# EAGLE schematic EEZ Arduino shield+BP r2B6b (EAGLE 6.1)
Assembly variants: Farnell, TME

## Sheet 1 of 4
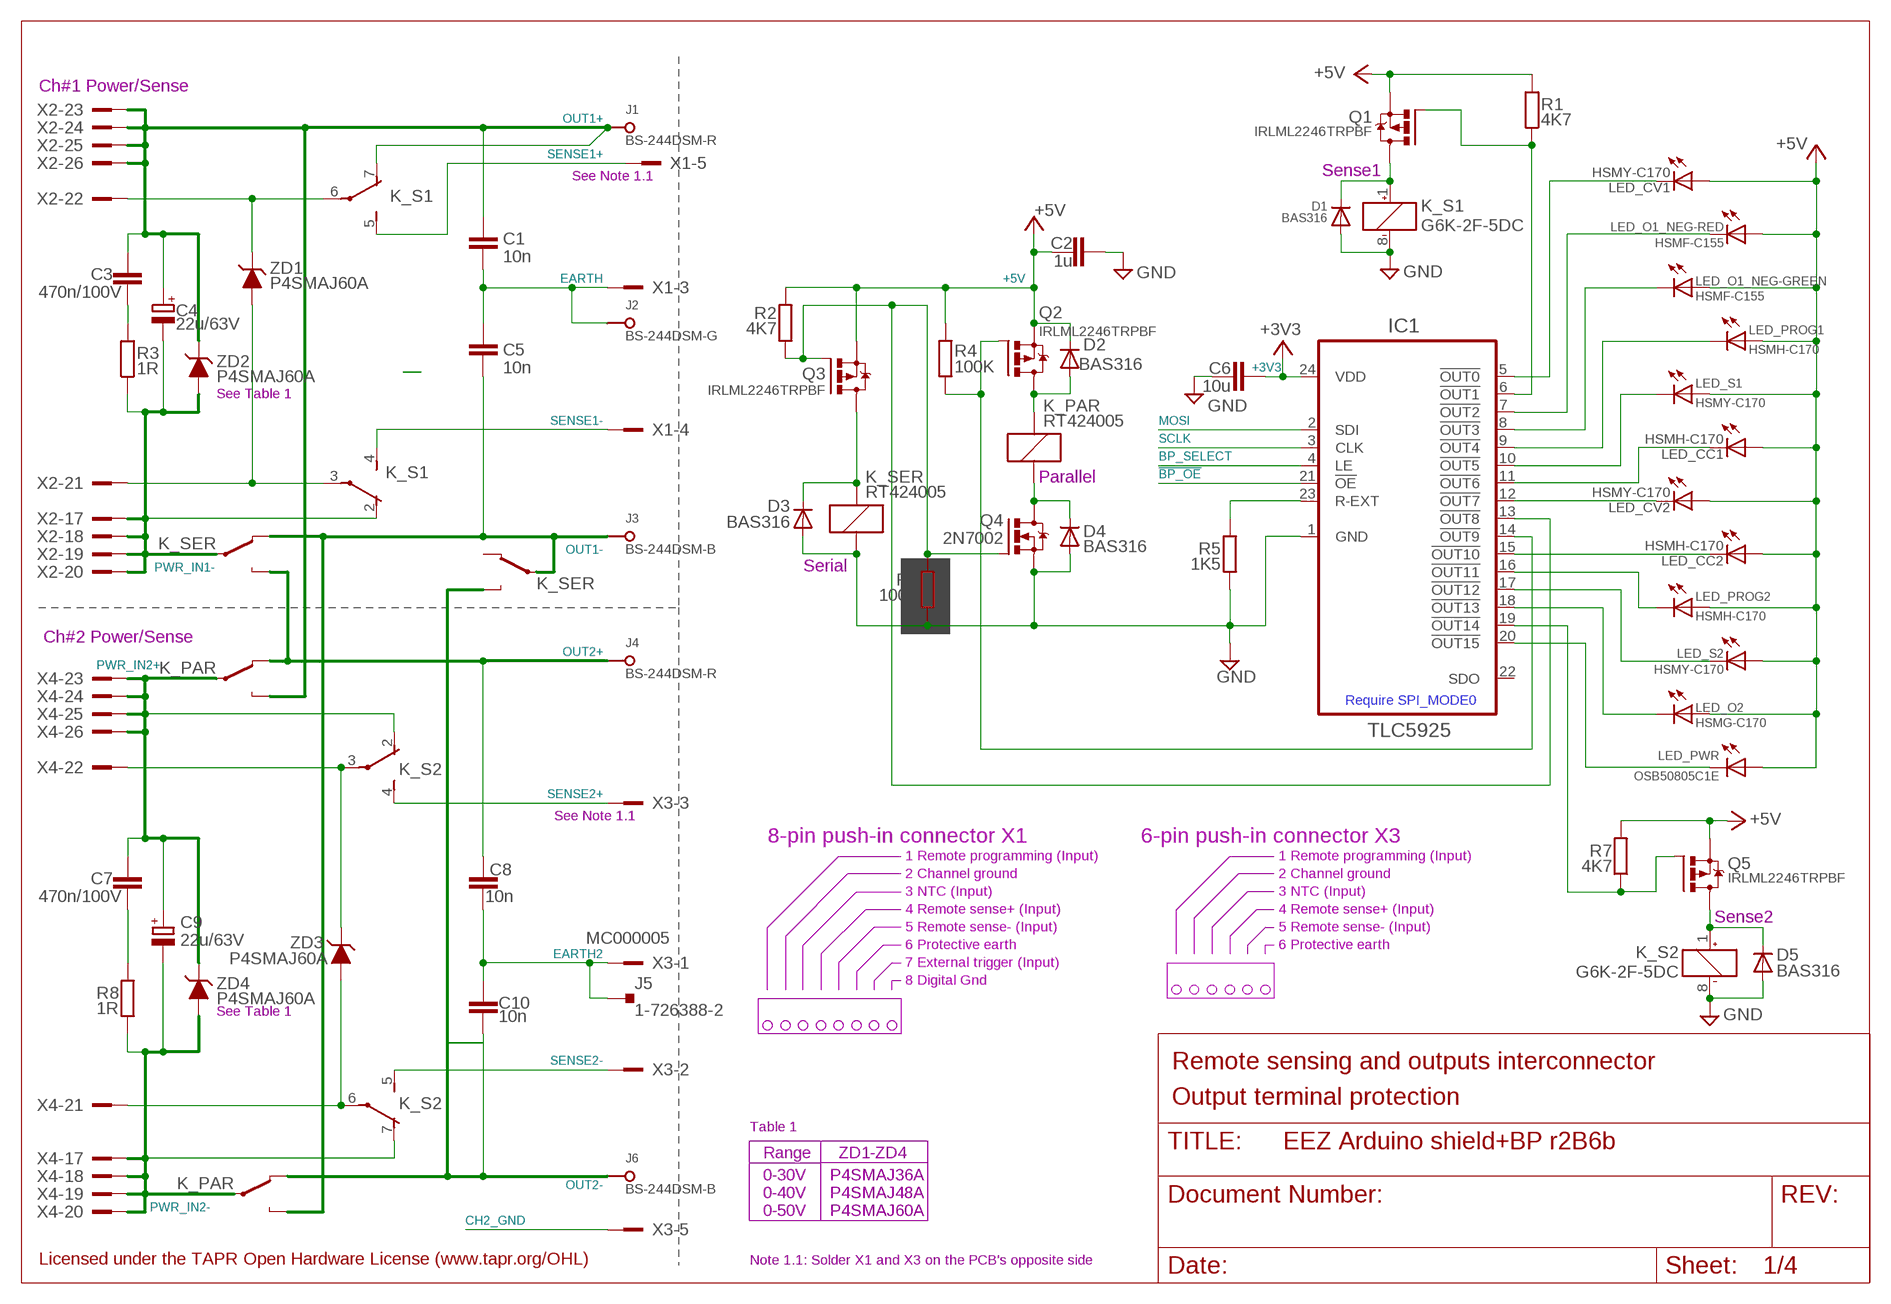
[diagram p0: schematic, sheet 1]

### Parts
C1  10n  C-EUC1206  [C1206]
C2  1u  C-EUC0805  [C0805]
C3  470n/100V  C-EUC1812  [C1812]
C4  22u/63V  ECAPEEEFK+2.5MM  [CAPAE660X610N_COMBO2]
C5  10n  C-EUC1206  [C1206]
C6  10u  C-EUC1206  [C1206]
C7  470n/100V  C-EUC1812  [C1812]
C8  10n  C-EUC1206  [C1206]
C9  22u/63V  ECAPEEEFK+2.5MM  [CAPAE660X610N_COMBO2]
C10  10n  C-EUC1206  [C1206]
D1  BAS316  DIODE-SOD323-W  [SOD323-W]
D2  BAS316  DIODE-SOD323-W  [SOD323-W]
D3  BAS316  DIODE-SOD323-W  [SOD323-W]
D4  BAS316  DIODE-SOD323-W  [SOD323-W]
D5  BAS316  DIODE-SOD323-W  [SOD323-W]
IC1  TLC5925  TLC5925IDBQR  [SOP63P600X175-24N]
J1  BS-244DSM-R  BINDING_POST-2  [BP_5_12]
J2  BS-244DSM-G  BINDING_POST-2  [BP_5_12]
J3  BS-244DSM-B  BINDING_POST-2  [BP_5_12]
J4  BS-244DSM-R  BINDING_POST-2  [BP_5_12]
J5  1-726388-2  PCB_TAB4.8MM  [PCB_TAB-4.8MM]
J6  BS-244DSM-B  BINDING_POST-2  [BP_5_12]
K_PAR  RT424005  RELAY_RT314012-2  [RT-C/016A5_ROUND]
K_S1  G6K-2F-5DC  G6K-2F  [G6K-2F]
K_S2  G6K-2F-5DC  G6K-2F  [G6K-2F]
K_SER  RT424005  RELAY_RT314012-2  [RT-C/016A5_ROUND]
LED_CC1  HSMH-C170  LEDCHIPLED_0805  [CHIPLED_0805]
LED_CC2  HSMH-C170  LEDCHIPLED_0805  [CHIPLED_0805]
LED_CV1  HSMY-C170  LEDCHIPLED_0805  [CHIPLED_0805]
LED_CV2  HSMY-C170  LEDCHIPLED_0805  [CHIPLED_0805]
LED_O1_NEG  HSMF-C155  LED_KPB-3025  [LED_KPB-3025]
LED_O2  HSMG-C170  LEDCHIPLED_0805  [CHIPLED_0805]
LED_PROG1  HSMH-C170  LEDCHIPLED_0805  [CHIPLED_0805]
LED_PROG2  HSMH-C170  LEDCHIPLED_0805  [CHIPLED_0805]
LED_PWR  OSB50805C1E  LEDCHIPLED_0805  [CHIPLED_0805]
LED_S1  HSMY-C170  LEDCHIPLED_0805  [CHIPLED_0805]
LED_S2  HSMY-C170  LEDCHIPLED_0805  [CHIPLED_0805]
Q1  IRLML2246TRPBF  [SOT95P237X112-3N]
Q2  IRLML2246TRPBF  [SOT95P237X112-3N]
Q3  IRLML2246TRPBF  [SOT95P237X112-3N]
Q4  2N7002  [SOT103P240X110-3N]
Q5  IRLML2246TRPBF  [SOT95P237X112-3N]
R1  4K7  R-EU_R0805  [R0805]
R2  4K7  R-EU_R0805  [R0805]
R3  1R  R-EU_R0805  [R0805]
R4  100K  R-EU_R0805  [R0805]
R5  1K5  R-EU_R0805  [R0805]
R6  100K  R-EU_R0805  [R0805]
R7  4K7  R-EU_R0805  [R0805]
R8  1R  R-EU_R0805  [R0805]
X1  MC000006  MC000006MIRROR  [MC000006_MIRROR]
X2  TSW-113-07-F-D  [TSW-113-07-F-D]
X3  MC000005  MC000005MIRROR  [MC000005_MIRROR]
X4  TSW-113-07-F-D  [TSW-113-07-F-D]
ZD1  P4SMAJ60A  PSMAXX  [DO214AC]
ZD2  P4SMAJ60A  PSMAXX  [DO214AC]
ZD3  P4SMAJ60A  PSMAXX  [DO214AC]
ZD4  P4SMAJ60A  PSMAXX  [DO214AC]

### Nets
!BP_OE: IC1.21(!OE) ; also sheet 2
!BP_OUT0: IC1.5(!OUT0) LED_CV1.C
!BP_OUT1: IC1.6(!OUT1) Q1.1(G) R1.1
!BP_OUT2: IC1.7(!OUT2) LED_O1_NEG.4(-RED:C)
!BP_OUT3: IC1.8(!OUT3) LED_O1_NEG.2(-GREEN:C)
!BP_OUT4: IC1.9(!OUT4) LED_PROG1.C
!BP_OUT5: IC1.10(!OUT5) LED_S1.C
!BP_OUT6: IC1.11(!OUT6) LED_CC1.C
!BP_OUT7: IC1.12(!OUT7) LED_CV2.C
!BP_OUT8: IC1.13(!OUT8) Q3.1(G) Q4.1(G) R2.1 R6.2
!BP_OUT9: IC1.14(!OUT9) Q2.1(G) R4.1
!BP_OUT10: IC1.15(!OUT10) LED_CC2.C
!BP_OUT12: IC1.17(!OUT12) LED_S2.C
!BP_OUT13: IC1.18(!OUT13) LED_O2.C
!BP_OUT14: IC1.19(!OUT14) Q5.1(G) R7.1
!BP_OUT15: IC1.20(!OUT15) LED_PWR.C
+3V3 [power]: C6.1 IC1.24(VDD) ; also sheet 2,3,4
+5V: C2.1 D2.C LED_CC1.A LED_CC2.A LED_CV1.A LED_CV2.A LED_O1_NEG.1(-GREEN:A) LED_O1_NEG.3(-RED:A) LED_O2.A LED_PROG1.A LED_PROG2.A LED_PWR.A LED_S1.A LED_S2.A Q1.2(S) Q2.2(S) Q3.2(S) Q5.2(S) R1.2 R2.2 R4.2 R7.2 ; also sheet 2,3,4
BP_SELECT: IC1.4(LE) ; also sheet 2
CH2_GND: X3.5 X3.5.1 ; also sheet 2,4
EARTH: C1.2 C5.1 J2.P$1 X1.3 X1.3.1
EARTH2: C8.2 C10.1 J5.P$1 J5.P$2 X3.1 X3.1.1 ; also sheet 3
GND [gnd]: C2.2 C6.2 D1.A D3.A D4.A D5.A IC1.1(GND) K_S1.8(1:-) K_S2.8(1:-) K_SER.A1(C2) Q4.2(S) R5.1 R6.1 ; also sheet 2,3,4
MOSI: IC1.2(SDI) ; also sheet 2,3
N$8: D1.C K_S1.1(1:+) Q1.3(D)
N$9: D5.C K_S2.1(1:+) Q5.3(D)
N$31: C3.2 R3.2
N$32: C7.2 R8.2
N$37: IC1.16(!OUT11) LED_PROG2.C
N$155: D3.C K_SER.A2(C1) Q3.3(D)
N$156: D2.A K_PAR.A2(C1) Q2.3(D)
N$306: IC1.23(R-EXT) R5.2
OUT1+: C1.1 C3.1 C4.1(+) C4.1.1(+) J1.P$1 K_PAR.14B(O) K_S1.7(3:O) X2.23 X2.24 X2.25 X2.26 ZD2.C
OUT1-: C5.2 J3.P$1 K_PAR.14A(O) K_SER.11A(P) K_SER.12B(S)
OUT2+: C8.1 J4.P$1 K_PAR.12B(S) K_SER.14B(O)
OUT2-: C10.2 J6.P$1 K_PAR.12A(S) K_SER.14A(O)
PWR_IN1-: C4.2(-) C4.2.1(-) K_S1.2(2:O) K_SER.11B(P) R3.1 X2.17 X2.18 X2.19 X2.20 ZD2.A
PWR_IN2+: C7.1 C9.1(+) C9.1.1(+) K_PAR.11B(P) K_S2.2(2:O) X4.23 X4.24 X4.25 X4.26 ZD4.C
PWR_IN2-: C9.2(-) C9.2.1(-) K_PAR.11A(P) K_S2.7(3:O) R8.1 X4.17 X4.18 X4.19 X4.20 ZD4.A
SCLK: IC1.3(CLK) ; also sheet 2,3
SENSE1+: K_S1.5(3:S) X1.5 X1.5.1
SENSE1-: K_S1.4(2:S) X1.4 X1.4.1
SENSE1_IN+: K_S1.6(3:P) X2.22 ZD1.C
SENSE1_IN-: K_S1.3(2:P) X2.21 ZD1.A
SENSE2+: K_S2.4(2:S) X3.3 X3.3.1
SENSE2-: K_S2.5(3:S) X3.2 X3.2.1
SENSE2_IN+: K_S2.3(2:P) X4.22 ZD3.C
SENSE2_IN-: K_S2.6(3:P) X4.21 ZD3.A
V-2: D4.C K_PAR.A1(C2) Q4.3(D)
Unconnected: IC1.22(SDO) K_SER.12A(S) X3.4 X3.4.1

### Notes on the sheet
- Ch#1 Power/Sense
- Sense1
- See Note 1.1
- See Table 1
- Parallel
- Serial
- Ch#2 Power/Sense
- Require SPI_MODE0
- See Note 1.1
- 8-pin push-in connector X1 | 6-pin push-in connector X3
- 1 Remote programming (Input) | 1 Remote programming (Input)
- 2 Channel ground | 2 Channel ground
- 3 NTC (Input) | 3 NTC (Input)
- 4 Remote sense+ (Input) | 4 Remote sense+ (Input)
- Sense2
- 5 Remote sense- (Input) | 5 Remote sense- (Input)
- 6 Protective earth | 6 Protective earth
- 7 External trigger (Input)
- 8 Digital Gnd
- See Table 1
- Remote sensing and outputs interconnector
- Output terminal protection
- Table 1
- Range | ZD1-ZD4
- 0-30V | P4SMAJ36A
- 0-40V | P4SMAJ48A
- 0-50V | P4SMAJ60A
- Licensed under the TAPR Open Hardware License (www.tapr.org/OHL) | Note 1.1: Solder X1 and X3 on the PCB's opposite side

## Sheet 2 of 4
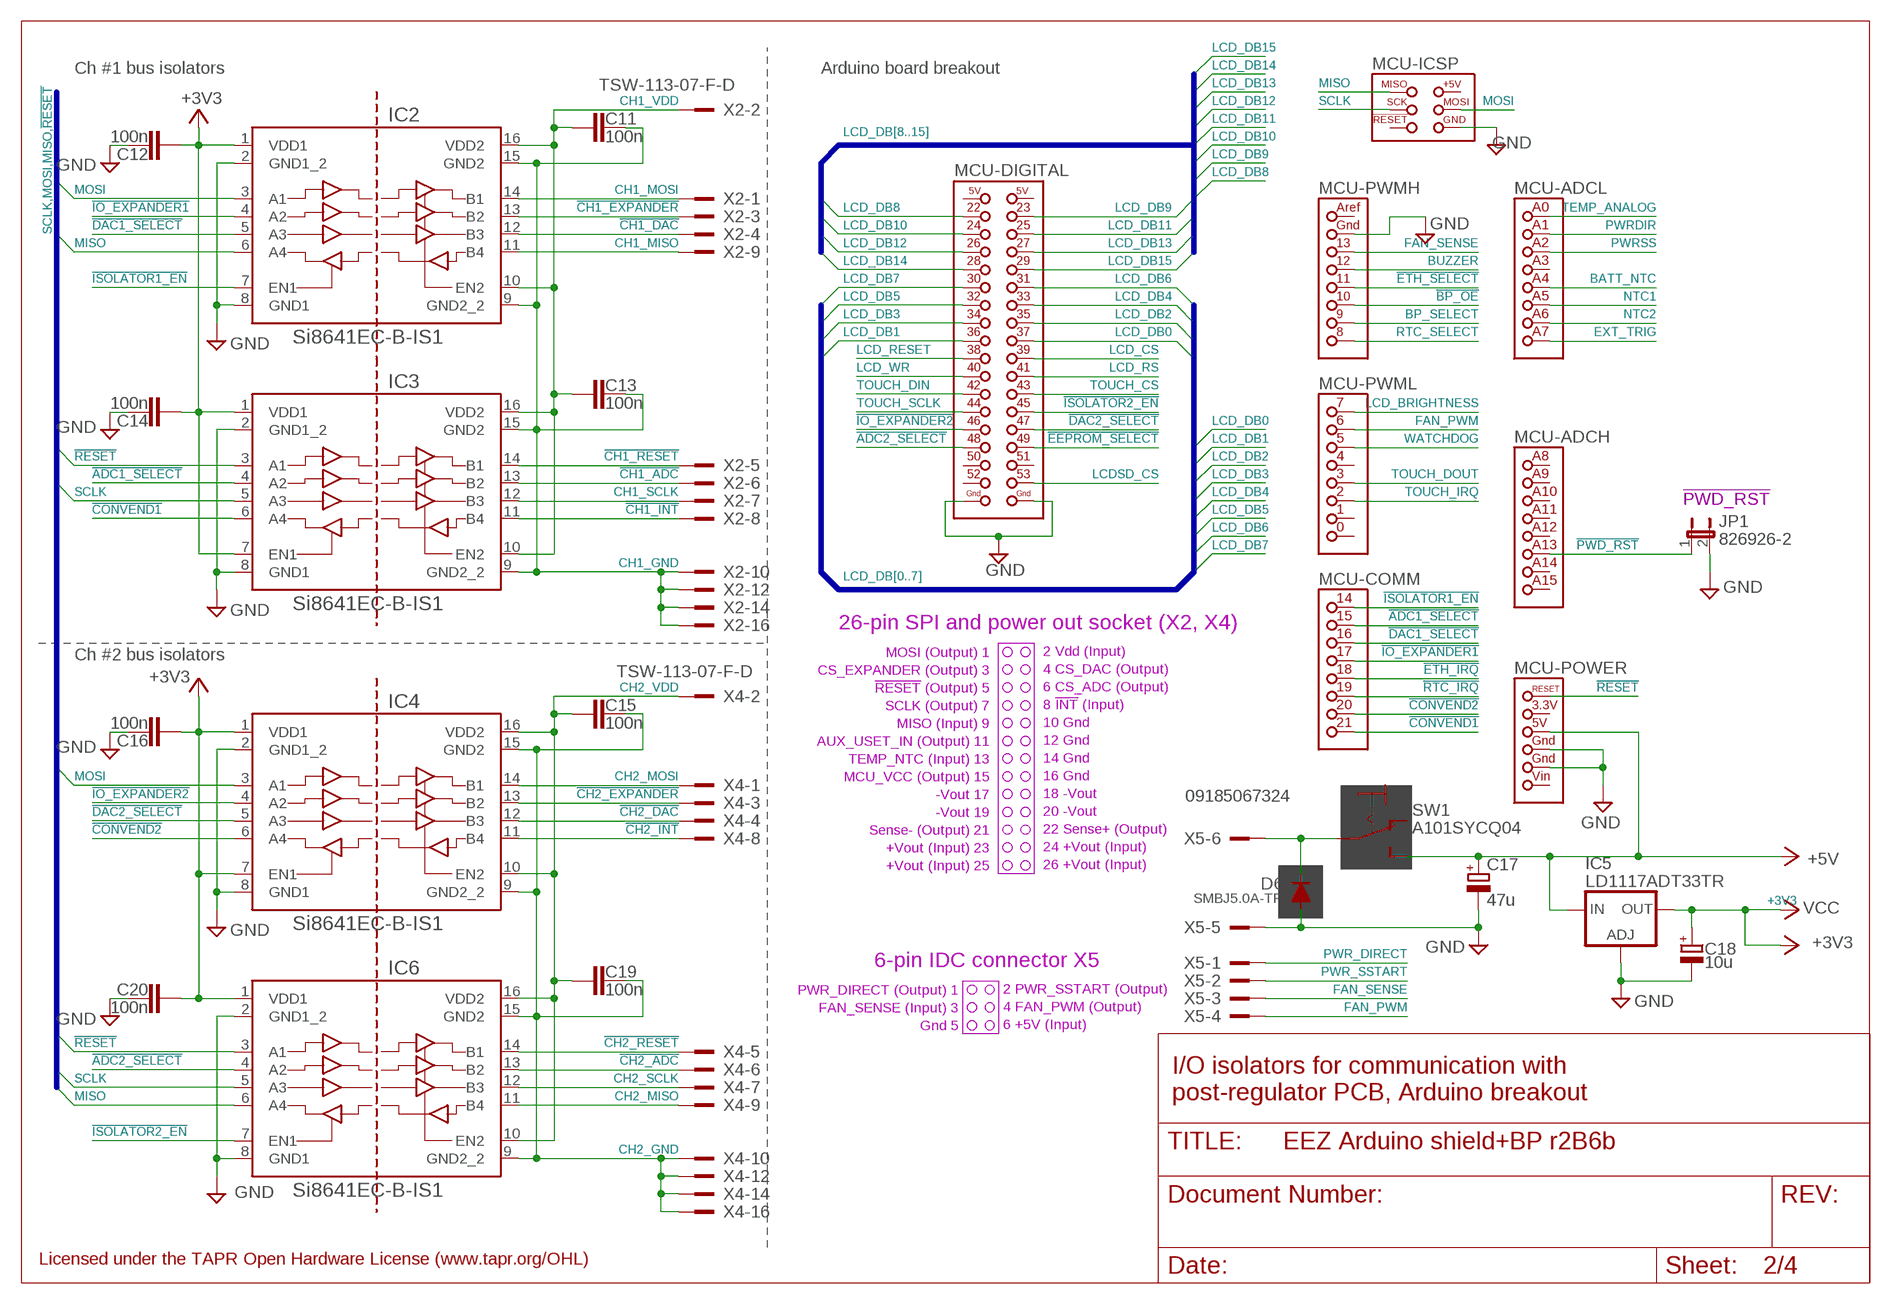
[diagram p1: schematic, sheet 2]

### Parts
C11  100n  C-EUC0603  [C0603]
C12  100n  C-EUC0603  [C0603]
C13  100n  C-EUC0603  [C0603]
C14  100n  C-EUC0603  [C0603]
C15  100n  C-EUC0603  [C0603]
C16  100n  C-EUC0603  [C0603]
C17  47u  ECAPPANASONIC_C  [PANASONIC_C]
C18  10u  ECAPPANASONIC_C  [PANASONIC_C]
C19  100n  C-EUC0603  [C0603]
C20  100n  C-EUC0603  [C0603]
D6  SMBJ5.0A-TR  DIODEDO214AA  [DO214AA]
IC2  Si8641EC-B-IS1  SI8641NSOIC-16  [SOIC-16]
IC3  Si8641EC-B-IS1  SI8641NSOIC-16  [SOIC-16]
IC4  Si8641EC-B-IS1  SI8641NSOIC-16  [SOIC-16]
IC5  LD1117ADT33TR  LD117ADT33TR  [DPACK]
IC6  Si8641EC-B-IS1  SI8641NSOIC-16  [SOIC-16]
JP1  826926-2  JP1E  [JP1]
MCU  Arduino Due  ARDUINO_MEGA+ICSPMIRROR  [ARDUINO+ICSP_MIRROR]
SW1  A101SYCQ04  M9040P  [M9040P]
X5  09185067324  IDC-6PIN  [IDC-6PIN]

### Nets
!ADC1_SELECT: IC3.4(A2) MCU.15
!ADC2_SELECT: IC6.4(A2) MCU.48(-DIGITAL:48(PL3))
!BP_OE: MCU.10 ; also sheet 1
!CH1_ADC: IC3.13(B2) X2.6
!CH1_DAC: IC2.12(B3) X2.4
!CH1_EXPANDER: IC2.13(B2) X2.3
!CH1_INT: IC3.11(B4) X2.8
!CH1_RESET: IC3.14(B1) X2.5
!CH2_ADC: IC6.13(B2) X4.6
!CH2_DAC: IC4.12(B3) X4.4
!CH2_EXPANDER: IC4.13(B2) X4.3
!CH2_INT: IC4.11(B4) X4.8
!CH2_RESET: IC6.14(B1) X4.5
!CONVEND1: IC3.6(A4) MCU.21
!CONVEND2: IC4.6(A4) MCU.20
!DAC1_SELECT: IC2.5(A3) MCU.16
!DAC2_SELECT: IC4.5(A3) MCU.47(-DIGITAL:47(PL4))
!EEPROM_SELECT: MCU.49(-DIGITAL:49(PL2)) ; also sheet 3
!ETH_IRQ: MCU.18 ; also sheet 3
!ETH_SELECT: MCU.11 ; also sheet 3
!IO_EXPANDER1: IC2.4(A2) MCU.17
!IO_EXPANDER2: IC4.4(A2) MCU.46(-DIGITAL:46(PL5))
!ISOLATOR1_EN: IC2.7(EN1) MCU.14
!ISOLATOR2_EN: IC6.7(EN1) MCU.45(-DIGITAL:45(PL6))
!PWD_RST: JP1.1 MCU.A13(-ADCH:ADC13)
!RESET: IC3.3(A1) IC6.3(A1) MCU.RESET(-POWER:!RESET) ; also sheet 3,4
!RTC_IRQ: MCU.19 ; also sheet 3
+3V3 [power]: C12.1 C14.1 C16.1 C18.1(+) C20.1 IC2.1(VDD1) IC3.1(VDD1) IC3.7(EN1) IC4.1(VDD1) IC4.7(EN1) IC5.4(OUT) IC6.1(VDD1) ; supply symbol labelled VCC ; also sheet 1,3,4
+5V: C17.1(+) IC5.3(IN) MCU.5V(-POWER:5V) SW1.3(S) ; also sheet 1,3,4
BATT_NTC: MCU.A4(-ADCL:ADC4) ; also sheet 4
BP_SELECT: MCU.9(-PWMH:9(PH6)) ; also sheet 1
BUZZER: MCU.12 ; also sheet 3
CH1_GND: C11.2 C13.2 IC2.9(GND2_2) IC2.15(GND2) IC3.9(GND2_2) IC3.15(GND2) X2.10 X2.12 X2.14 X2.16 ; also sheet 4
CH1_MISO: IC2.11(B4) X2.9
CH1_MOSI: IC2.14(B1) X2.1
CH1_SCLK: IC3.12(B3) X2.7
CH1_VDD: C11.1 C13.1 IC2.10(EN2) IC2.16(VDD2) IC3.10(EN2) IC3.16(VDD2) X2.2 ; also sheet 4
CH2_GND: C15.2 C19.2 IC4.9(GND2_2) IC4.15(GND2) IC6.9(GND2_2) IC6.15(GND2) X4.10 X4.12 X4.14 X4.16 ; also sheet 1,4
CH2_MISO: IC6.11(B4) X4.9
CH2_MOSI: IC4.14(B1) X4.1
CH2_SCLK: IC6.12(B3) X4.7
CH2_VDD: C15.1 C19.1 IC4.10(EN2) IC4.16(VDD2) IC6.10(EN2) IC6.16(VDD2) X4.2
EXT_TRIG: MCU.A7(-ADCL:ADC7) ; also sheet 4
FAN_PWM: MCU.6(-PWML:6(PH3)) X5.4
FAN_SENSE: MCU.13 X5.3
GND [gnd]: C12.2 C14.2 C16.2 C17.2(-) C18.2(-) C20.2 D6.A IC2.2(GND1_2) IC2.8(GND1) IC3.2(GND1_2) IC3.8(GND1) IC4.2(GND1_2) IC4.8(GND1) IC5.1(ADJ) IC6.2(GND1_2) IC6.8(GND1) JP1.2 MCU.GND1(-POWER:GND1) MCU.GND2(-POWER:GND2) MCU.GND3(-DIGITAL:GND3) MCU.GND4(-DIGITAL:GND4) MCU.GND(-PWMH:GND) MCU.ICSP_GND(-ICSP:GND) X5.5 ; also sheet 1,3,4
LCD_BRIGHTNESS: MCU.7(-PWML:7(PH4)) ; also sheet 3
LCD_CS: MCU.39(-DIGITAL:39(PC0)) ; also sheet 3
LCD_DB0: MCU.37(-DIGITAL:37(PC2)) ; also sheet 3
LCD_DB1: MCU.36(-DIGITAL:36(PC3)) ; also sheet 3
LCD_DB2: MCU.35(-DIGITAL:35(PC4)) ; also sheet 3
LCD_DB3: MCU.34(-DIGITAL:34(PC5)) ; also sheet 3
LCD_DB4: MCU.33(-DIGITAL:33(PC6)) ; also sheet 3
LCD_DB5: MCU.32(-DIGITAL:32(PC7)) ; also sheet 3
LCD_DB6: MCU.31(-DIGITAL:31(PA7)) ; also sheet 3
LCD_DB7: MCU.30(-DIGITAL:30(PA6)) ; also sheet 3
LCD_DB8: MCU.22 ; also sheet 3
LCD_DB9: MCU.23 ; also sheet 3
LCD_DB10: MCU.24(-DIGITAL:24(PA0)) ; also sheet 3
LCD_DB11: MCU.25(-DIGITAL:25(PA1)) ; also sheet 3
LCD_DB12: MCU.26(-DIGITAL:26(PA2)) ; also sheet 3
LCD_DB13: MCU.27(-DIGITAL:27(PA3)) ; also sheet 3
LCD_DB14: MCU.28(-DIGITAL:28(PA4)) ; also sheet 3
LCD_DB15: MCU.29(-DIGITAL:29(PA5)) ; also sheet 3
LCD_RESET: MCU.38(-DIGITAL:38(PC1)) ; also sheet 3
LCD_RS: MCU.41(-DIGITAL:41(PG2)) ; also sheet 3
LCD_WR: MCU.40(-DIGITAL:40(PD7)) ; also sheet 3
LCDSD_CS: MCU.53(-DIGITAL:53(PB2/MOSI)) ; also sheet 3
MISO: IC2.6(A4) IC6.6(A4) MCU.ICSP_MISO(-ICSP:MISO) ; also sheet 3
MOSI: IC2.3(A1) IC4.3(A1) MCU.ICSP_MOSI(-ICSP:MOSI) ; also sheet 1,3
N$1: D6.C SW1.2(P) X5.6
NTC1: MCU.A5(-ADCL:ADC5) ; also sheet 3
NTC2: MCU.A6(-ADCL:ADC6) ; also sheet 3
PWR_DIRECT: X5.1 ; also sheet 4
PWR_SSTART: X5.2 ; also sheet 4
PWRDIR: MCU.A1(-ADCL:ADC1) ; also sheet 4
PWRSS: MCU.A2(-ADCL:ADC2) ; also sheet 4
RTC_SELECT: MCU.8(-PWMH:8(PH5)) ; also sheet 3
SCLK: IC3.5(A3) IC6.5(A3) MCU.ICSP_SCK(-ICSP:SCK) ; also sheet 1,3
TEMP_ANALOG: MCU.A0(-ADCL:ADC0) ; also sheet 3
TOUCH_CS: MCU.43(-DIGITAL:43(PG0)) ; also sheet 3
TOUCH_DIN: MCU.42(-DIGITAL:42(PG1)) ; also sheet 3
TOUCH_DOUT: MCU.3(-PWML:3(PE5)) ; also sheet 3
TOUCH_IRQ: MCU.2(-PWML:2(PE4)) ; also sheet 3
TOUCH_SCLK: MCU.44(-DIGITAL:44(PL7)) ; also sheet 3
WATCHDOG: MCU.5(-PWML:5(PE3)) ; also sheet 4
Unconnected: MCU.0(-PWML:0(PE0)) MCU.1(-PWML:1(PE1)) MCU.3.3V(-POWER:3V3) MCU.4(-PWML:4(PG5)) MCU.5V(1)(-DIGITAL:5V(1)) MCU.5V(2)(-DIGITAL:5V(2)) MCU.50(-DIGITAL:50(PL1/MISO)) MCU.51(-DIGITAL:51(PL0)) MCU.52(-DIGITAL:52(PB3/SCK)) MCU.A3(-ADCL:ADC3) MCU.A8(-ADCH:ADC8) MCU.A9(-ADCH:ADC9) MCU.A10(-ADCH:ADC10) MCU.A11(-ADCH:ADC11) MCU.A12(-ADCH:ADC12) MCU.A14(-ADCH:ADC14) MCU.A15(-ADCH:ADC15) MCU.AREF(-PWMH:AREF) MCU.ICSP_+5V(-ICSP:+5V) MCU.ICSP_RESET(-ICSP:!RESET) MCU.VIN(-POWER:VIN) SW1.1(O)

### Buses
SCLK,MOSI,MISO,!RESET
LCD_DB[8..15]
LCD_DB[0..7]

### Notes on the sheet
- Ch #1 bus isolators | Arduino board breakout
- !PWD_RST
- 26-pin SPI and power out socket (X2, X4)
- MOSI (Output) 1
- 2 Vdd (Input)
- Ch #2 bus isolators
- CS_EXPANDER (Output) 3
- 4 CS_DAC (Output)
- !RESET! (Output) 5
- 6 CS_ADC (Output)
- SCLK (Output) 7
- 8 !INT! (Input)
- MISO (Input) 9
- 10 Gnd
- AUX_USET_IN (Output) 11
- 12 Gnd
- TEMP_NTC (Input) 13
- 14 Gnd
- MCU_VCC (Output) 15
- 16 Gnd
- -Vout 17
- 18 -Vout
- -Vout 19
- 20 -Vout
- Sense- (Output) 21
- 22 Sense+ (Output)
- +Vout (Input) 23
- 24 +Vout (Input)
- +Vout (Input) 25
- 26 +Vout (Input)
- 6-pin IDC connector X5
- PWR_DIRECT (Output) 1
- 2 PWR_SSTART (Output)
- FAN_SENSE (Input) 3
- 4 FAN_PWM (Output)
- Gnd 5
- 6 +5V (Input)
- I/O isolators for communication with
- post-regulator PCB, Arduino breakout
- Licensed under the TAPR Open Hardware License (www.tapr.org/OHL)

## Sheet 3 of 4
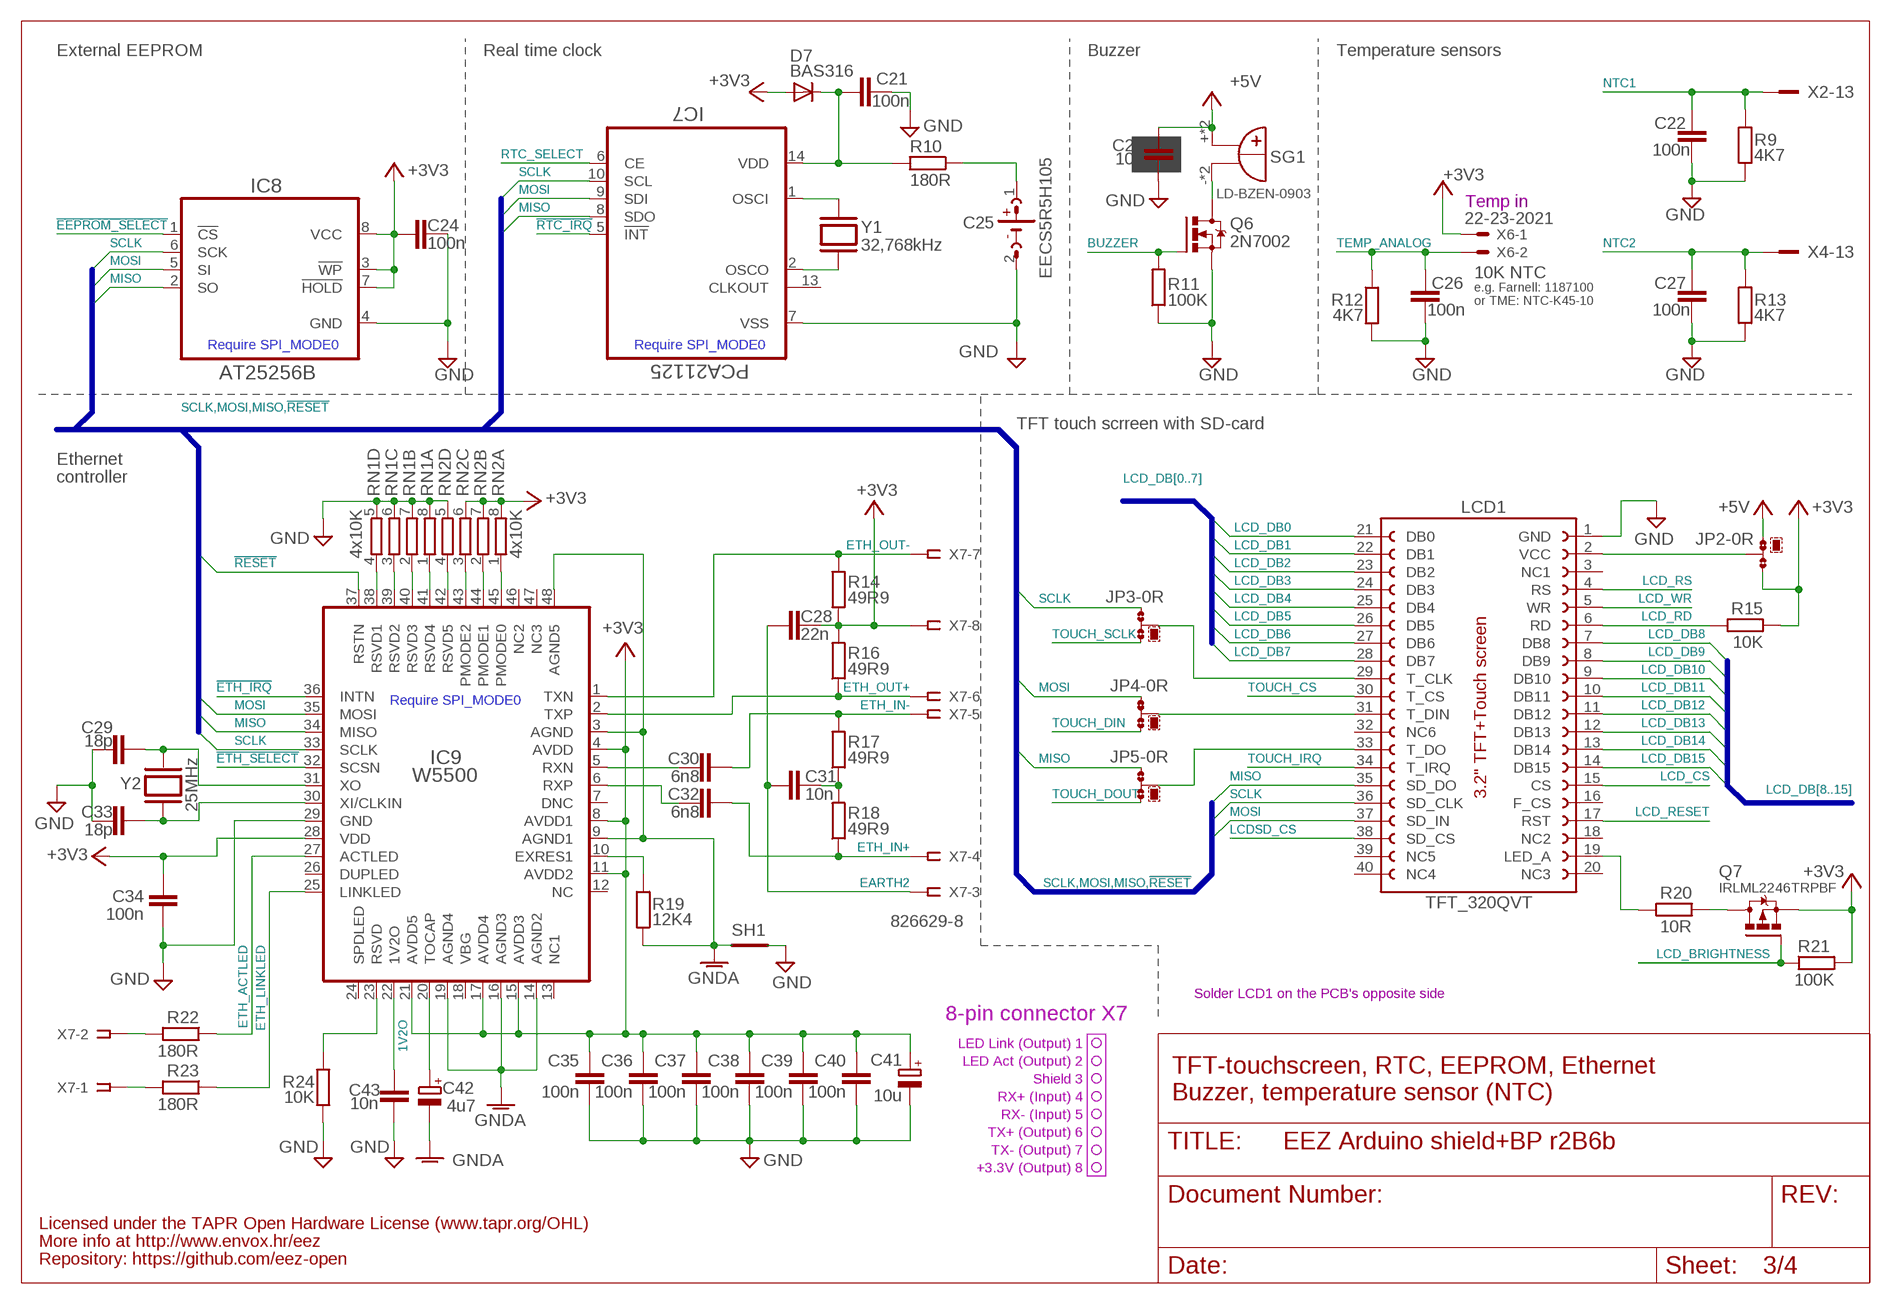
[diagram p2: schematic, sheet 3]

### Parts
C21  100n  C-EUC0603  [C0603]
C22  100n  C-EUC0603  [C0603]
C23  10u  C-EUC1206  [C1206]
C24  100n  C-EUC0603  [C0603]
C25  EECS5R5H105  SUPER_CAP  [SG-R20MM]
C26  100n  C-EUC0603  [C0603]
C27  100n  C-EUC0603  [C0603]
C28  22n  C-EUC0805  [C0805]
C29  18p  C-EUC0603  [C0603]
C30  6n8  C-EUC0603  [C0603]
C31  10n  C-EUC0805  [C0805]
C32  6n8  C-EUC0603  [C0603]
C33  18p  C-EUC0603  [C0603]
C34  100n  C-EUC0603  [C0603]
C35  100n  C-EUC0603  [C0603]
C36  100n  C-EUC0603  [C0603]
C37  100n  C-EUC0603  [C0603]
C38  100n  C-EUC0603  [C0603]
C39  100n  C-EUC0603  [C0603]
C40  100n  C-EUC0603  [C0603]
C41  10u  ECAP1206  [EC1206]
C42  4u7  ECAP1206  [EC1206]
C43  10n  C-EUC0805  [C0805]
D7  BAS316  DIODE-SOD323-W  [SOD323-W]
IC7  PCA21125  PCA21125TSSOP-14  [SOP65P640X120-14N]
IC8  AT25256B  AT25XXXSOIC8  [SOIC127P600X175-8N]
IC9  W5500  [TQFP48-7X7]
JP2  0R-JUMPA  [A0R-JMP]
JP3  0R-JUMPA  [A0R-JMP]
JP4  0R-JUMPA  [A0R-JMP]
JP5  0R-JUMPA  [A0R-JMP]
LCD1  TFT_320QVT  LCD_TFT_320QVTMIRROR  [LCD_TFT_320QVT_MIRROR]
Q6  2N7002  [SOT103P240X110-3N]
Q7  IRLML2246TRPBF  [SOT95P237X112-3N]
R9  4K7  R-EU_R0805  [R0805]
R10  180R  R-EU_R0805  [R0805]
R11  100K  R-EU_R0805  [R0805]
R12  4K7  R-EU_R0805  [R0805]
R13  4K7  R-EU_R0805  [R0805]
R14  49R9  R-EU_R0805  [R0805]
R15  10K  R-EU_R0805  [R0805]
R16  49R9  R-EU_R0805  [R0805]
R17  49R9  R-EU_R0805  [R0805]
R18  49R9  R-EU_R0805  [R0805]
R19  12K4  R-EU_R0805  [R0805]
R20  10R  R-EU_R0805  [R0805]
R21  100K  R-EU_R0805  [R0805]
R22  180R  R-EU_R0805  [R0805]
R23  180R  R-EU_R0805  [R0805]
R24  10K  R-EU_R0805  [R0805]
RN1  4x10K  R_ARRAY4  [CAY16]
RN2  4x10K  R_ARRAY4  [CAY16]
SG1  LD-BZEN-0903  BUZZER  [BUZZER]
SH1  SHORTNOHOLE  [SHORT_NOHOLE]
X6  22-23-2021  [22-23-2021]
X7  826629-8  SSW-108-02-S-S  [SSW-108-02-S-S]
Y1  32,768kHz  XTALR26  [R26_XTAL]
Y2  25MHz  XTALSMD  [HC-49/4H]

### Nets
1V2O: C43.2 IC9.22(1V2O)
!EEPROM_SELECT: IC8.1(!CS) ; also sheet 2
!ETH_IRQ: IC9.36(INTN) ; also sheet 2
!ETH_SELECT: IC9.32(SCSN) ; also sheet 2
!RESET: IC9.37(RSTN) ; also sheet 2,4
!RTC_IRQ: IC7.5(!INT) ; also sheet 2
+3V3 [power]: C24.1 C28.1 C34.2 C35.1 C36.1 C37.1 C38.1 C39.1 C40.1 C41.+ D7.A IC8.3(!WP) IC8.7(!HOLD) IC8.8(VCC) IC9.4(AVDD) IC9.8(AVDD1) IC9.11(AVDD2) IC9.15(AVDD3) IC9.17(AVDD4) IC9.21(AVDD5) IC9.28(VDD) JP2.3 Q7.2(S) R14.1 R15.2 R16.2 R21.2 RN2.6 RN2.7 RN2.8 X6.1 X7.8 ; also sheet 1,2,4
+5V: C23.2 JP2.1 SG1.+ SG1.+B(+) ; also sheet 1,2,4
BUZZER: Q6.1(G) R11.2 ; also sheet 2
EARTH2: C28.2 C31.2 X7.3 ; also sheet 1
ETH_ACTLED: IC9.27(ACTLED) R22.1
ETH_IN+: C32.1 R18.1 X7.4
ETH_IN-: C30.1 R17.2 X7.5
ETH_LINKLED: IC9.25(LINKLED) R23.1
ETH_OUT+: IC9.2(TXP) R16.1 X7.6
ETH_OUT-: IC9.1(TXN) R14.2 X7.7
GND [gnd]: C21.1 C22.1 C23.1 C24.2 C25.2(-) C26.1 C27.1 C29.2 C33.2 C34.1 C35.2 C36.2 C37.2 C38.2 C39.2 C40.2 C41.- C43.1 IC7.7(VSS) IC8.4(GND) IC9.29(GND) LCD1.1(GND) Q6.2(S) R9.2 R11.1 R12.2 R13.2 R24.1 RN1.5 RN1.6 RN1.7 RN1.8 RN2.5 SH1.P$1(GND_A) ; also sheet 1,2,4
GNDA [gnd]: C42.- IC9.3(AGND) IC9.9(AGND1) IC9.14(AGND2) IC9.16(AGND3) IC9.19(AGND4) IC9.48(AGND5) R19.1 SH1.P$2(GND_B)
LCD_BRIGHTNESS: Q7.1(G) R21.1 ; also sheet 2
LCD_CS: LCD1.15(CS) ; also sheet 2
LCD_DB0: LCD1.21(DB0) ; also sheet 2
LCD_DB1: LCD1.22(DB1) ; also sheet 2
LCD_DB2: LCD1.23(DB2) ; also sheet 2
LCD_DB3: LCD1.24(DB3) ; also sheet 2
LCD_DB4: LCD1.25(DB4) ; also sheet 2
LCD_DB5: LCD1.26(DB5) ; also sheet 2
LCD_DB6: LCD1.27(DB6) ; also sheet 2
LCD_DB7: LCD1.28(DB7) ; also sheet 2
LCD_DB8: LCD1.7(DB8) ; also sheet 2
LCD_DB9: LCD1.8(DB9) ; also sheet 2
LCD_DB10: LCD1.9(DB10) ; also sheet 2
LCD_DB11: LCD1.10(DB11) ; also sheet 2
LCD_DB12: LCD1.11(DB12) ; also sheet 2
LCD_DB13: LCD1.12(DB13) ; also sheet 2
LCD_DB14: LCD1.13(DB14) ; also sheet 2
LCD_DB15: LCD1.14(DB15) ; also sheet 2
LCD_RD: LCD1.6(RD) R15.1
LCD_RESET: LCD1.17(RST) ; also sheet 2
LCD_RS: LCD1.4(RS) ; also sheet 2
LCD_WR: LCD1.5(WR) ; also sheet 2
LCDSD_CS: LCD1.38(SD_CS) ; also sheet 2
LED_A: LCD1.19(LED_A) R20.2
MISO: IC7.8(SDO) IC8.2(SO) IC9.34(MISO) JP5.1 LCD1.35(SD_DO) ; also sheet 2
MOSI: IC7.9(SDI) IC8.5(SI) IC9.35(MOSI) JP4.1 LCD1.37(SD_IN) ; also sheet 1,2
N$2: JP5.2 LCD1.33(T_DO)
N$4: C33.1 IC9.30(XI/CLKIN) Y2.2
N$5: IC9.23(RSVD) R24.2
N$6: C30.2 IC9.5(RXN)
N$7: C32.2 IC9.6(RXP)
N$10 [power]: JP2.2 LCD1.2(VCC)
N$11: IC9.43(PMODE2) RN2.3
N$12: IC9.44(PMODE1) RN2.2
N$13: Q7.3(D) R20.1
N$14: IC9.45(PMODE0) RN2.1
N$15: IC9.42(RSVD5) RN2.4
N$16: JP4.2 LCD1.31(T_DIN)
N$18: JP3.2 LCD1.29(T_CLK)
N$22: C25.1(+) R10.1
N$23: IC9.38(RSVD1) RN1.4
N$24: IC7.1(OSCI) Y1.1
N$25: IC7.2(OSCO) Y1.2
N$28: IC9.39(RSVD2) RN1.3
N$29: IC9.41(RSVD4) RN1.1
N$36: IC9.40(RSVD3) RN1.2
N$40: R23.2 X7.1
N$41: R22.2 X7.2
N$45: IC9.10(EXRES1) R19.2
N$71: Q6.3(D) SG1.- SG1.-B(-)
N$97: C29.1 IC9.31(XO) Y2.1
N$109: C21.2 D7.C IC7.14(VDD) R10.2
N$124: C31.1 R17.1 R18.2
NTC1: C22.2 R9.1 X2.13 ; also sheet 2
NTC2: C27.2 R13.1 X4.13 ; also sheet 2
RTC_SELECT: IC7.6(CE) ; also sheet 2
SCLK: IC7.10(SCL) IC8.6(SCK) IC9.33(SCLK) JP3.1 LCD1.36(SD_CLK) ; also sheet 1,2
TEMP_ANALOG: C26.2 R12.1 X6.2 ; also sheet 2
TOCAP: C42.+ IC9.20(TOCAP)
TOUCH_CS: LCD1.30(T_CS) ; also sheet 2
TOUCH_DIN: JP4.3 ; also sheet 2
TOUCH_DOUT: JP5.3 ; also sheet 2
TOUCH_IRQ: LCD1.34(T_IRQ) ; also sheet 2
TOUCH_SCLK: JP3.3 ; also sheet 2
Unconnected: IC7.13(CLKOUT) IC9.7(DNC) IC9.12(NC) IC9.13(NC1) IC9.18(VBG) IC9.24(SPDLED) IC9.26(DUPLED) IC9.46(NC2) IC9.47(NC3) LCD1.3(NC1) LCD1.16(F_CS) LCD1.18(NC2) LCD1.20(NC3) LCD1.32(NC6) LCD1.39(NC5) LCD1.40(NC4)

### Buses
SCLK,MOSI,MISO,!RESET
LCD_DB[0..7]
LCD_DB[8..15]

### Notes on the sheet
- External EEPROM | Real time clock | Buzzer | Temperature sensors
- Temp in
- 10K NTC
- e.g. Farnell: 1187100
- or TME: NTC-K45-10
- Require SPI_MODE0 | Require SPI_MODE0
- TFT touch scrreen with SD-card
- Ethernet
- controller
- Require SPI_MODE0
- Solder LCD1 on the PCB's opposite side
- 8-pin connector X7
- LED Link (Output) 1
- LED Act (Output) 2
- Shield 3 | TFT-touchscreen, RTC, EEPROM, Ethernet
- RX+ (Input) 4
- Buzzer, temperature sensor (NTC)
- RX- (Input) 5
- TX+ (Output) 6
- TX- (Output) 7
- +3.3V (Output) 8
- Licensed under the TAPR Open Hardware License (www.tapr.org/OHL)
- More info at http://www.envox.hr/eez
- Repository: https://github.com/eez-open

## Sheet 4 of 4
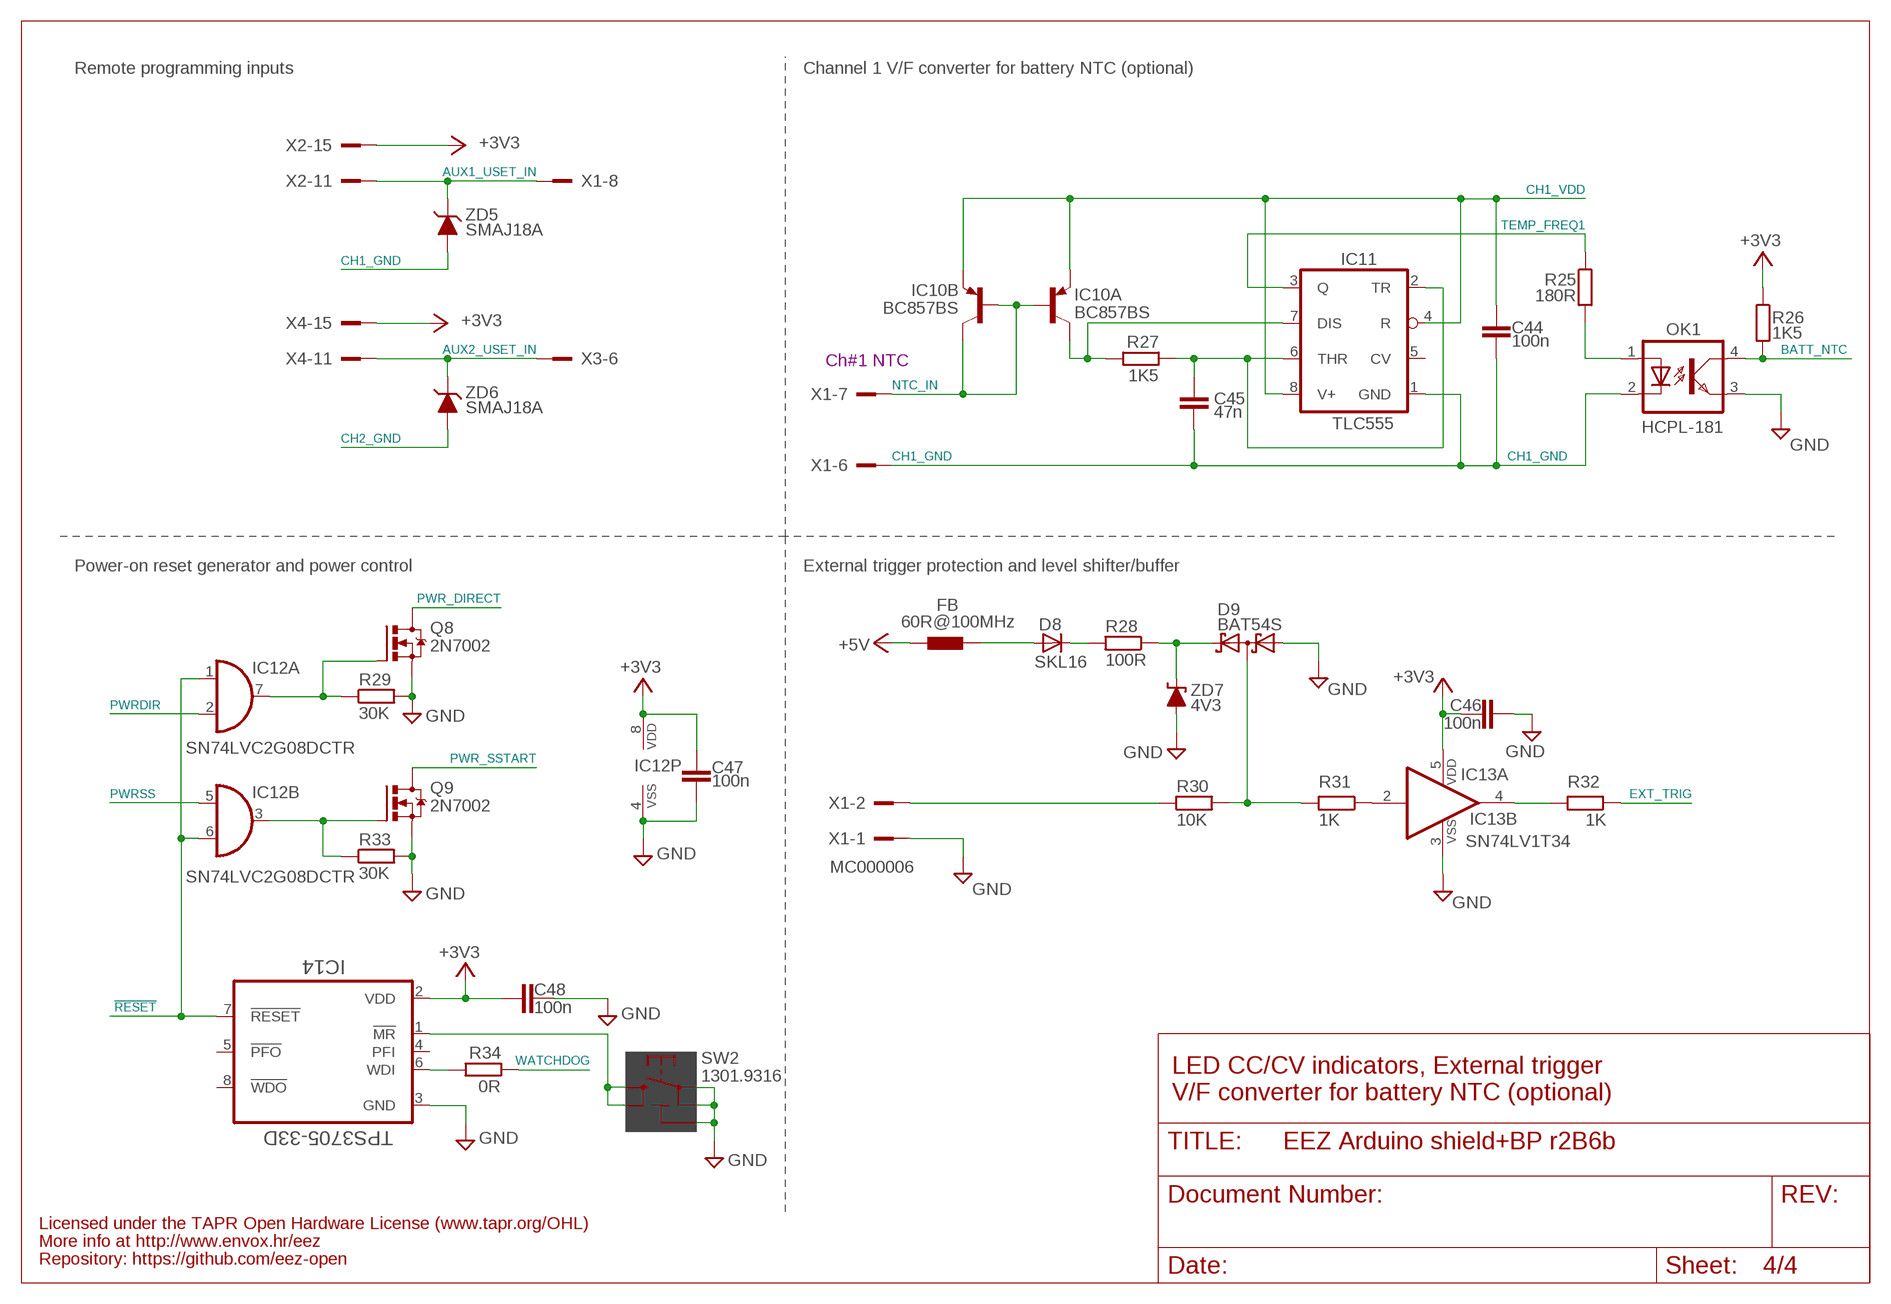
[diagram p3: schematic, sheet 4]

### Parts
C44  100n  C-EUC0603  [C0603]
C45  47n  C-EUC0805  [C0805]
C46  100n  C-EUC0603  [C0603]
C47  100n  C-EUC0603  [C0603]
C48  100n  C-EUC0603  [C0603]
D8  SKL16  DIODE-DO214AC  [DO214AC]
D9  BAT54S  [SOT23]
FB  60R@100MHz  FERRITE_BEAD0603  [BEAD0603]
IC10  BC857BS  [SOT65P210X110-6N]
IC11  TLC555  LM555SOIC8  [SOIC127P600X175-8N]
IC12  SN74LVC2G08DCTR  [SOP65P400X130-8N]
IC13  SN74LV1T34  [SOT95P280X145-5N]
IC14  TPS3705-33D  TPS3705XX  [SOIC127P600X175-8N]
OK1  HCPL-181  [HCPL-181]
Q8  2N7002  [SOT103P240X110-3N]
Q9  2N7002  [SOT103P240X110-3N]
R25  180R  R-EU_R0805  [R0805]
R26  1K5  R-EU_R0805  [R0805]
R27  1K5  R-EU_R0805  [R0805]
R28  100R  R-EU_R0805  [R0805]
R29  30K  R-EU_R0805  [R0805]
R30  10K  R-EU_R1206  [R1206]
R31  1K  R-EU_R0805  [R0805]
R32  1K  R-EU_R0805  [R0805]
R33  30K  R-EU_R0805  [R0805]
R34  0R  R-EU_R0805  [R0805]
SW2  1301.9316  TACT_SW  [TACTM-6XN]
ZD5  SMAJ18A  PSMAXX  [DO214AC]
ZD6  SMAJ18A  PSMAXX  [DO214AC]
ZD7  4V3  ZENER-DIODEMINIMELF  [MINIMELF]

### Nets
!RESET: IC12.1(A:I0) IC12.6(B:I1) IC14.7(!RESET) ; also sheet 2,3
+3V3 [power]: C46.1 C47.2 C48.2 IC12.8(P:VDD) IC13.5(B:VDD) IC14.2(VDD) R26.1 X2.15 X4.15 ; also sheet 1,2,3
+5V: FB.P$1 ; also sheet 1,2,3
AUX1_USET_IN: X1.8 X1.8.1 X2.11 ZD5.C
AUX2_USET_IN: X3.6 X3.6.1 X4.11 ZD6.C
BATT_NTC: OK1.4(COL) R26.2 ; also sheet 2
CH1_GND: C44.2 C45.1 IC11.1(GND) OK1.2(C) X1.6 X1.6.1 ZD5.A ; also sheet 2
CH1_VDD: C44.1 IC10.1(A:E) IC10.4(B:E) IC11.4(R) IC11.8(V+) ; also sheet 2
CH2_GND: ZD6.A ; also sheet 1,2
EXT_TRIG: R32.1 ; also sheet 2
GND [gnd]: C46.2 C47.1 C48.1 D9.1(A1) IC12.4(P:VSS) IC13.3(B:VSS) IC14.3(GND) OK1.3(EMIT) Q8.2(S) Q9.2(S) R29.2 R33.2 SW2.1 SW2.2 SW2.5(5-GND) X1.1 X1.1.1 ZD7.A ; also sheet 1,2,3
N$3: OK1.1(A) R25.2
N$17: IC10.6(A:C) IC11.7(DIS) R27.1
N$19: C45.2 IC11.2(TR) IC11.6(THR) R27.2
N$20: D9.2(C2) R28.1 ZD7.C
N$26: D9.3(C1A2) R30.2 R31.2
N$27: IC13.2(A:I) R31.1
N$30: IC13.4(A:O) R32.2
N$33: D8.C R28.2
N$34: R30.1 X1.2 X1.2.1
N$35: D8.A FB.P$2
N$39: IC14.1(!MR) SW2.3 SW2.4
N$42: IC14.6(WDI) R34.1
N$43: IC12.7(A:O) Q8.1(G) R29.1
N$44: IC12.3(B:O) Q9.1(G) R33.1
NTC_IN: IC10.2(A:B) IC10.3(B:C) IC10.5(B:B) X1.7 X1.7.1
PWR_DIRECT: Q8.3(D) ; also sheet 2
PWR_SSTART: Q9.3(D) ; also sheet 2
PWRDIR: IC12.2(A:I1) ; also sheet 2
PWRSS: IC12.5(B:I0) ; also sheet 2
TEMP_FREQ1: IC11.3(Q) R25.1
WATCHDOG: R34.2 ; also sheet 2
Unconnected: IC11.5(CV) IC14.4(PFI) IC14.5(!PFO) IC14.8(!WDO)

### Notes on the sheet
- Remote programming inputs | Channel 1 V/F converter for battery NTC (optional)
- Ch#1 NTC
- Power-on reset generator and power control | External trigger protection and level shifter/buffer
- LED CC/CV indicators, External trigger
- V/F converter for battery NTC (optional)
- Licensed under the TAPR Open Hardware License (www.tapr.org/OHL)
- More info at http://www.envox.hr/eez
- Repository: https://github.com/eez-open

## Library data of the parts
C1-C3 C5-C8 C10-C16 C19-C24 C26-C40 C43-C48 = rcl:C-EU: CAPACITOR, European symbol
C4 C9 C17 C18 = MyLib6:ECAP
C25 = EEZ_Lib1:SUPER_CAP: Electric Double Layer Supercapacitors, Type EDL Vertical - Manufacturer Part No: EDLSG105V5R5C Farnell: 2113011 Horizontal - Manufacturer Part No: EDLSG105H5R5C Farnell: 1364209, 9697497
C41 C42 = EEZ_Lib1:ECAP
D1-D5 D7 D8 = diode:DIODE-: DIODE
D6 = MyLib6:DIODE
D9 = diode:BAT54S: Schottky Diodes Pin connection corrected 2011-05-04 Source: Fairchild .. BAT54.pdf
FB = EEZ_Lib1:FERRITE_BEAD: FAIR-RITE - 2506033007Y3 - FERRITE BEAD, 0.04OHM, 3A, 0603 Farnell: 2112873
IC1 = MyLib6:TLC5925IDBQR: CONSTANT-CURRENT LED SINK DRIVER; MPN: TLC5925IDBQR; OC_FARNELL: 1694438; OC_NEWARK: 46P3784; PACKAGE: SOP-24; SUPPLIER: Texas Instruments
IC2-IC4 IC6 = EEZ_Lib1:SI8641: Low power 4-ch digital isolator (3+1) Farnell: 2423288
IC5 = v-reg:LD117A?*: Low drop fixed and adjustable positive voltage regulators 1 A Source: http://www.st.com/stonline/products/literature/ds/7194/ld1117axx.pdf
IC7 = MyLib6:PCA21125: SPI-bus Real-Time Clock and calendar Farnell: 2400445
IC8 = MyLib6:AT25XXX: SPI Serial EEPROM, Supports SPI Modes 0 (0,0) and 3 (1,1) Atmel AT25128 128K (16 384 x 8) Farnell: 2345601 Atmel AT25256 256K (32 768 x 8) Farnell: 1841577 Atmel AT25512 512K (65 536 x 8) Farnell: 2345608
IC9 = EEZ_Lib1:W5500: The W5500 chip is a Hardwired TCP/IP embedded Ethernet controller that enables easier internet connection for embedded systems using SPI (Serial Peripheral Interface). Case TQFP48; TME: W5500
IC10 = MyLib6:BC857BS: PNP general purpose dual transistor
IC11 = MyLib6:LM555
IC12 = EEZ_Lib1:SN74LVC2G08DCTR: DUAL 2-INPUT POSITIVE-AND GATE; MPN: SN74LVC2G08DCTR; OC_FARNELL: 1470871; OC_NEWARK: 68K1120; PACKAGE: SSOP-8; SUPPLIER: Texas Instruments
IC13 = EEZ_Lib1:SN74LV1T34: Single Power Supply Single Buffer GATE CMOS Logic Level Shifter; FARNELL: 2499914
IC14 = EEZ_Lib1:TPS3705XX: Processor supervisory circuit with power-fail; FARNELL: 2296066
J1-J4 J6 = EEZ_Lib1:BINDING_POST
J5 = EEZ_Lib1:PCB_TAB
JP1 = jumper:JP1E: JUMPER
JP2-JP5 = jump-0r-smd:0R-JUMP: SMD 0R 0805 Jumper
K_PAR K_SER = EEZ_Lib1:RELAY_RT314012
K_S1 K_S2 = relay:G6K: Low Signal Relay oeiwcsnts1.omron.com/.. D20G6K0100.pdf; MF: OMRON COMPONENTS USA; MPN: G6K-2F DC24; OC_FARNELL: 1690427; OC_NEWARK: 36K7467
LCD1 = EEZ_Lib1:LCD_TFT_320QVT: 3.2" 320x240 TFT Module Display Touch Panel with PCB 262K Colors IC SSD1289
LED_CC1 LED_CC2 LED_CV1 LED_CV2 LED_O2 LED_PROG1 LED_PROG2 LED_PWR LED_S1 LED_S2 = led:LED: LED OSRAM: - CHIPLED LG R971, LG N971, LY N971, LG Q971, LY Q971, LO R971, LY R971 LH N974, LH R974 LS Q976, LO Q976, LY Q976 LO Q996 - Hyper CHIPLED LW Q18S LB Q993, LB Q99A, LB R99A - SideLED LS A670, LO A670, LY A670, LG A670, LP A670 LB A673, LV A673, LT A673, LW A673 LH A674 LY A675 LS A676, LA A676, LO A676, LY A676, LW A676 LS A679, LY A679, LG A679 - Hyper Micro SIDELED® LS Y876, LA Y876, LO Y876, LY Y876 LT Y87S - SmartLED LW L88C, LW L88S LB L89C, LB L89S, LG L890 LS L89K, LO L89K, LY L89K LS L896, LA L896, LO L896, LY L896 - TOPLED LS T670, LO T670, LY T670, LG T670, LP T670 LSG T670, LSP T670, LSY T670, LOP T670, LYG T670 LG T671, LOG T671, LSG T671 LB T673, LV T673, LT T673, LW T673 LH T674 LS T676, LA T676, LO T676, LY T676, LB T676, LH T676, LSB T676, LW T676 LB T67C, LV T67C, LT T67C, LS T67K, LO T67K, LY T67K, LW E67C LS E67B, LA E67B, LO E67B, LY E67B, LB E67C, LV E67C, LT E67C LW T67C LS T679, LY T679, LG T679 LS T770, LO T770, LY T770, LG T770, LP T770 LB T773, LV T773, LT T773, LW T773 LH T774 LS E675, LA E675, LY E675, LS T675 LS T776, LA T776, LO T776, LY T776, LB T776 LHGB T686 LT T68C, LB T68C - Hyper Mini TOPLED® LB M676 - Mini TOPLED Santana® LG M470 LS M47K, LO M47K, LY M47K Source: http://www.osram.convergy.de LUXEON: - LUMILED® LXK2-PW12-R00, LXK2-PW12-S00, LXK2-PW14-U00, LXK2-PW14-V00 LXK2-PM12-R00, LXK2-PM12-S00, LXK2-PM14-U00 LXK2-PE12-Q00, LXK2-PE12-R00, LXK2-PE12-S00, LXK2-PE14-T00, LXK2-PE14-U00 LXK2-PB12-K00, LXK2-PB12-L00, LXK2-PB12-M00, LXK2-PB14-N00, LXK2-PB14-P00, LXK2-PB14-Q00 LXK2-PR12-L00, LXK2-PR12-M00, LXK2-PR14-Q00, LXK2-PR14-R00 LXK2-PD12-Q00, LXK2-PD12-R00, LXK2-PD12-S00 LXK2-PH12-R00, LXK2-PH12-S00 LXK2-PL12-P00, LXK2-PL12-Q00, LXK2-PL12-R00 Source: www.luxeon.com KINGBRIGHT: KA-3528ASYC Source: www.kingbright.com
LED_O1_NEG = EEZ_Lib1:LED_KPB-3025: Kingbright 3.0x2.5mm SURFACE MOUNT LED LAMP
MCU = EEZ_Lib1:ARDUINO_MEGA+ICSP
OK1 = EEZ_Lib1:HCPL-181: Phototransistor Optocoupler SMD Mini-Flat Type
Q1-Q3 Q5 Q7 = MyLib6:IRLML2246TRPBF: HEXFET Power MOSFET (-20V, -2.6A); MPN: IRLML2246TRPBF; OC_FARNELL: 1888166; OC_NEWARK: 40T7450; PACKAGE: SOT-3; SUPPLIER: International Rectifier; TME: IRLML2246TRPBF
Q4 Q6 Q8 Q9 = MyLib6:2N7002: N-CHANNEL ENHANCEMENT MODE FIELD EFFECT TRANSISTOR; MPN: 2N7002-7-F; OC_FARNELL: 1713823; OC_NEWARK: 25R5679; PACKAGE: SOT-23-3; SUPPLIER: DIODES INC.
R1-R29 R31-R34 = rcl:R-EU_: RESISTOR, European symbol
R30 = resistor:R-EU_: RESISTOR, European symbol
RN1 RN2 = EEZ_Lib1:R_ARRAY4: 1206 four resistor array
SG1 = MyLib6:BUZZER
SH1 = EEZ_Lib1:SHORT
SW1 = switch:M9040P: TOGGLE SWITCH Marquardt
SW2 = MyLib6:TACT_SW
X1 = EEZ_Lib1:MC000006: Wire-To-Board Terminal Block, 8, 150 V, 6 A, 26 AWG, 20 AWG No. of Positions:8; Rated Voltage:150V; Rated Current:6A; FARNELL: 2007972
X2 X4 = EEZ_Lib1:TSW-113-07-F-D: Samtec TSW-110-07-F-D Header, 2.54MM, THT, 26-way; FARNELL: 2025182
X3 = EEZ_Lib1:MC000005: Wire-To-Board Terminal Block, 6, 150 V, 6 A, 26 AWG, 20 AWG No. of Positions:6; Rated Voltage:150V; Rated Current:6A
X5 = EEZ_Lib1:IDC-6PIN: 6-pin IDC socket male, straight; FARNELL: 1096984; TME: 09185067324
X6 = con-molex:22-23-2021: .100" (2.54mm) Center Header - 2 Pin; MF: MOLEX; MPN: 22-23-2021; OC_FARNELL: 1462926; OC_NEWARK: 25C3832
X7 = con-samtec:SSW-108-02-S-S: THROUGH-HOLE .025" SQ POST SOCKET Source: Samtec SSW.pdf; MPN: SSW-108-02-S-S; OC_FARNELL: unknown; OC_NEWARK: 11P9448
Y1 Y2 = MyLib6:XTAL
ZD1-ZD6 = EEZ_Lib1:PSMAXX: Transient Voltage Suppressor, TVS, P4SMA Series, Unidirectional
ZD7 = EEZ_Lib1:ZENER-DIODE

## Net classes
0 default: width 0.254 mm, drill 0.584 mm, clearance 0.254 mm
1 power: width 0.254 mm, drill 0.584 mm, clearance 0.254 mm
2 gnd: width 0.254 mm, drill 0.584 mm, clearance 0.254 mm
3 isolators: width 0.254 mm, drill 0.584 mm, clearance 0.254 mm